# EAGLE design sensor_board_ma700 (EAGLE 7.2.0)
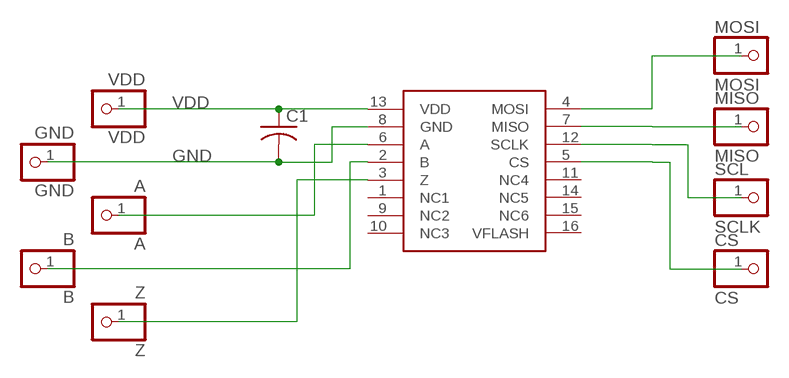
[diagram p0: schematic, sheet 1]

## Parts
A  A  PINHD-1X1  [1X01]
B  B  PINHD-1X1  [1X01]
C1  C-USC0603  [C0603]
CS  CS  PINHD-1X1  [1X01]
GND  GND  PINHD-1X1  [1X01]
MA700  MA700  [QFN16]
MISO  MISO  PINHD-1X1  [1X01]
MOSI  MOSI  PINHD-1X1  [1X01]
SCL  SCLK  PINHD-1X1  [1X01]
VDD  VDD  PINHD-1X1  [1X01]
Z  Z  PINHD-1X1  [1X01]

## Nets
GND: C1.2 GND.1 MA700.8(GND)
N$1: B.1 MA700.2(B)
N$4: CS.1 MA700.5(CS)
N$5: A.1 MA700.6(A)
N$9: MA700.3(Z) Z.1
N$12: MA700.7(MISO) MISO.1
N$13: MA700.12(SCLK) SCL.1
N$15: MA700.4(MOSI) MOSI.1
VDD: C1.1 MA700.13(VDD) VDD.1
Unconnected: MA700.1(NC1) MA700.9(NC2) MA700.10(NC3) MA700.11(NC4) MA700.14(NC5) MA700.15(NC6) MA700.16(VFLASH)

## Library data of the parts
A B CS GND MISO MOSI SCL VDD Z = pinhead:PINHD-1X1: PIN HEADER
C1 = rcl:C-US: CAPACITOR, American symbol
MA700 = BenLibrary:MA700

## Board
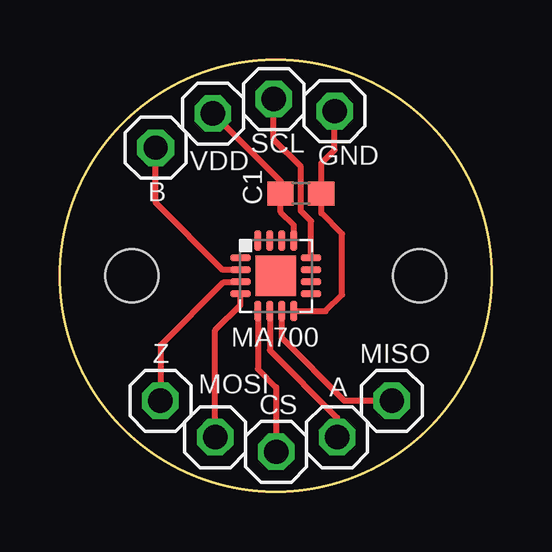
[diagram p1: board, top side]

Size 18 x 18 mm. Coordinates in mm from the lower left corner, seen from the top.
Outline: circle at 9,9 radius 9
Copper layers (1*16): Top 0.035mm / dielectric 1.5mm / Bottom 0.035mm
Design rules "default": minimum track width 10mil, minimum drill 24mil, track to track 8mil, track to pad 8mil, pad to pad 8mil, via to via 8mil, smd to smd 8mil, copper to edge 40mil, drill to drill 8mil, minimum pad ring 10mil, minimum via ring 8mil, stop-mask expansion 4mil, vias tented up to drill 0mil, thermal gap 10mil
Holes 2.2 mm at 15,9 3,9

### Footprints (pad centres in the part's own frame; a part is rotated, then mirrored left to right if it is on the bottom)
1X01 = drill 1.016 octagon: 1 0,0
C0603 = smd 1.1 x 1: 1 -0.85,0; 2 0.85,0
QFN16 = smd 0.85 x 0.3: 1 -1.475,0.75; 2 -1.475,0.25; 3 -1.475,-0.25; 4 -1.475,-0.75; 9 1.475,-0.75; 10 1.475,-0.25; 11 1.475,0.25; 12 1.475,0.75 | smd 0.3 x 0.85: 5 -0.75,-1.475; 6 -0.25,-1.475; 7 0.25,-1.475; 8 0.75,-1.475; 13 0.75,1.475; 14 0.25,1.475; 15 -0.25,1.475; 16 -0.75,1.475 | smd 1.7 x 1.7: TH 0,0

### Placement (x,y rotation side)
A  11.56,2.27 0 top
B  3.99,14.34 0 top
C1  10.05,12.44 0 top
CS  9.02,1.66 0 top
GND  11.46,15.87 0 top
MA700  9,9 0 top
MISO  13.84,3.79 0 top
MOSI  6.48,2.27 0 top
SCL  8.92,16.37 0 top
VDD  6.38,15.77 0 top
Z  4.19,3.79 0 top

### Tracks (layer width: path | path; a pad name or v marks a point on that pad's centre or on a via)
GND
  Top 0.254: MA700.8 11.08,7.53 11.76,8.21 11.76,10.75 10.9,11.61 C1.2 10.9,13.69 11.46,14.25 GND.1
N$1
  Top 0.254: MA700.2 6.79,9.25 3.99,12.05 B.1
N$4
  Top 0.254: MA700.5 8.25,5.12 9.02,4.35 CS.1
N$5
  Top 0.254: MA700.6 8.75,5.89 11.56,3.08 A.1
N$9
  Top 0.254: MA700.3 7.49,8.72 6.81,8.72 4.19,6.1 Z.1
N$12
  Top 0.254: MISO.1 11.86,3.79 9.25,6.4 MA700.7
N$13
  Top 0.254: MA700.12 10.47,11.27 10.05,11.7 10.05,13.55 8.92,14.68 SCL.1
N$15
  Top 0.254: MOSI.1 6.48,6.73 7.53,7.78 MA700.4
VDD
  Top 0.254: MA700.13 9.75,11.11 9.2,11.66 C1.1 9.2,12.94 VDD.1